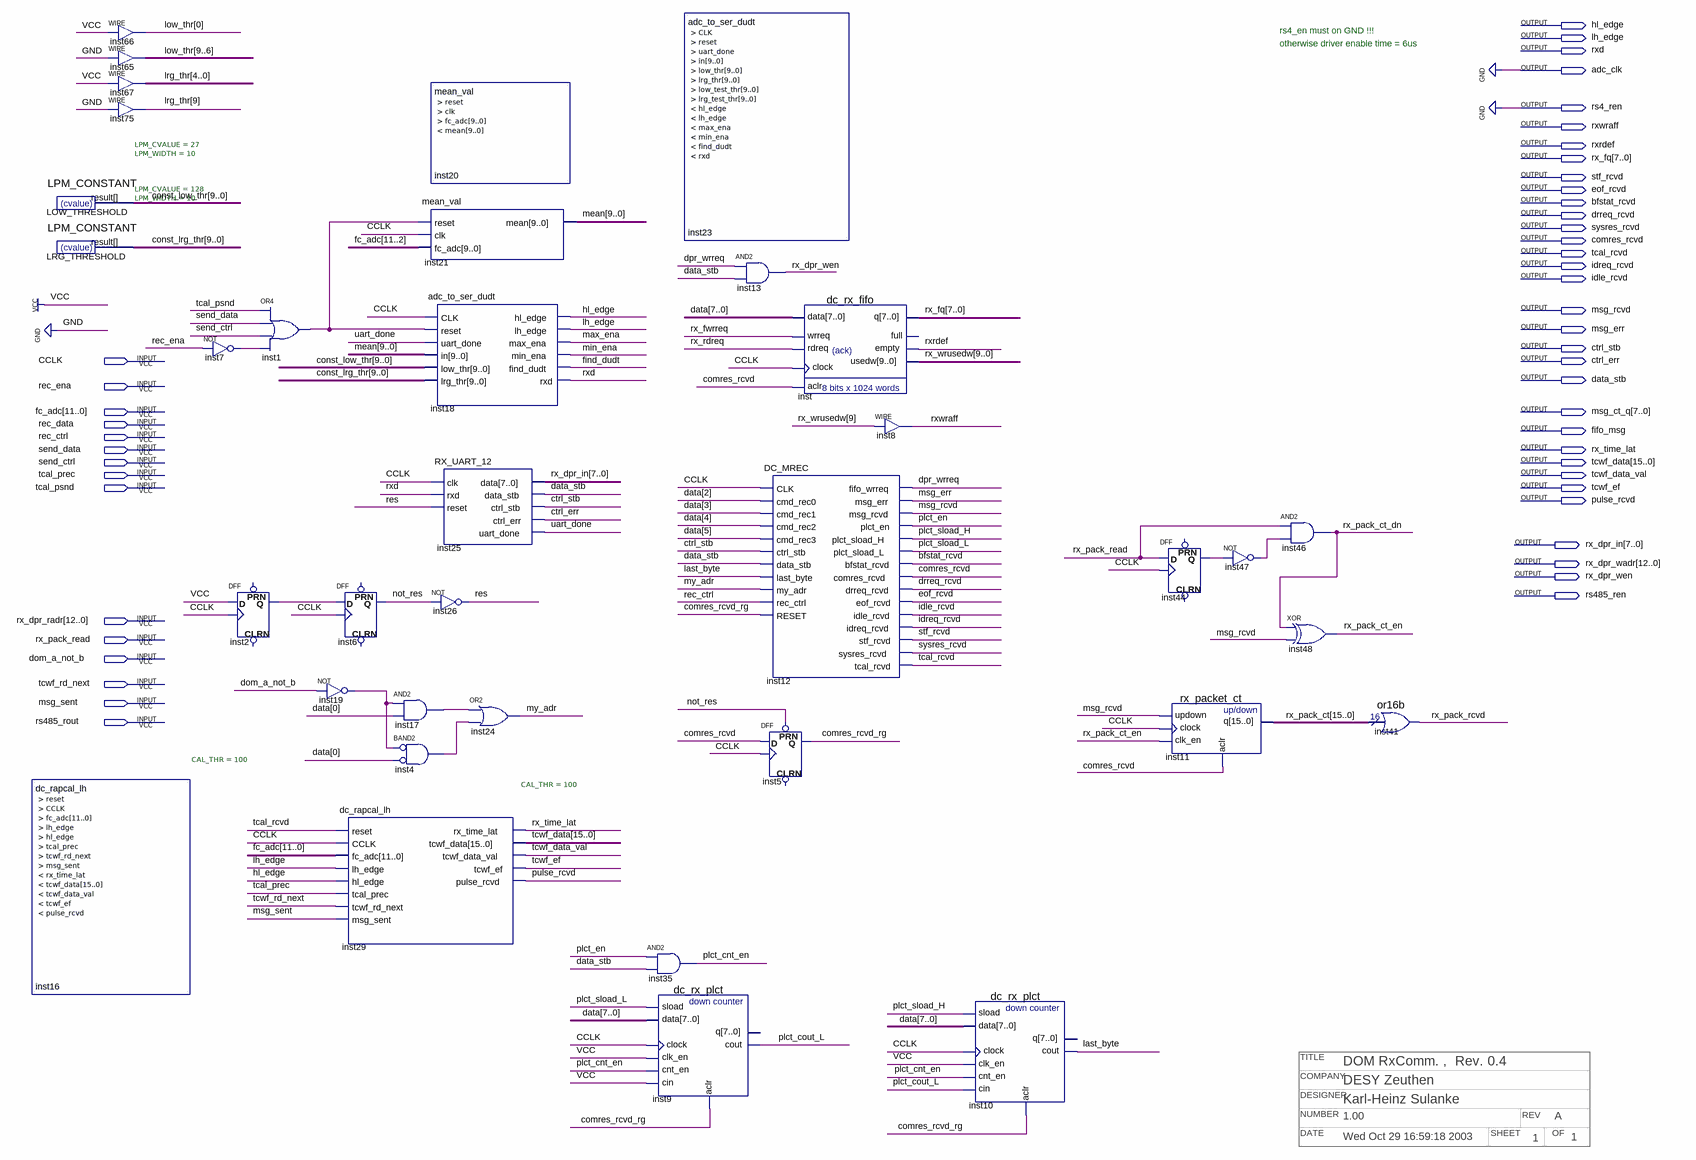
[diagram p0: schematic sheet]
// Quartus schematic DC_Rx_chan_dpr.bdf as structural Verilog: 36 symbols, 48 pins
// Title block: TITLE: DOM RxComm. ,  Rev. 0.4; COMPANY: DESY Zeuthen; DESIGNER: Karl-Heinz Sulanke; NUMBER: 1.00; REV: A; DATE: Wed Oct 29 16:59:18 2003; SHEET: 1; OF: 1
module DC_Rx_chan_dpr (
  input  CCLK,
  input  rec_ena,
  input  [11:0] fc_adc,
  input  rec_data,
  input  rec_ctrl,
  input  send_data,
  input  send_ctrl,
  input  tcal_prec,
  input  tcal_psnd,
  input  [12:0] rx_dpr_radr,
  input  rx_pack_read,
  input  dom_a_not_b,
  input  tcwf_rd_next,
  input  msg_sent,
  input  rs485_rout,
  output hl_edge,
  output lh_edge,
  output rxd,
  output adc_clk,
  output rs4_ren,
  output rxwraff,
  output rxrdef,
  output [7:0] rx_fq,
  output stf_rcvd,
  output eof_rcvd,
  output bfstat_rcvd,
  output drreq_rcvd,
  output sysres_rcvd,
  output comres_rcvd,
  output tcal_rcvd,
  output idreq_rcvd,
  output idle_rcvd,
  output msg_rcvd,
  output msg_err,
  output ctrl_stb,
  output ctrl_err,
  output data_stb,
  output [7:0] msg_ct_q,
  output fifo_msg,
  output rx_time_lat,
  output [15:0] tcwf_data,
  output tcwf_data_val,
  output tcwf_ef,
  output pulse_rcvd,
  output [7:0] rx_dpr_in,
  output [12:0] rx_dpr_wadr,
  output rx_dpr_wen,
  output rs485_ren
);

  wire comres_rcvd_rg, dpr_wrreq, find_dudt, inst1_out, inst2_q, inst4_out, inst7_out, inst17_out,
       inst19_out, inst44_q, inst47_out, last_byte, max_ena, min_ena, my_adr, not_res, plct_cnt_en,
       plct_cout_L, plct_en, plct_sload_H, plct_sload_L, res, rx_fwrreq, rx_pack_ct_dn, rx_pack_ct_en,
       rx_pack_rcvd, rx_rdreq, uart_done;
  wire [7:0] data;
  wire [9:0] const_low_thr, const_lrg_thr, low_thr, lrg_thr, mean, rx_wrusedw;
  wire [15:0] rx_pack_ct;

  LPM_CONSTANT #(.LPM_CVALUE(27), .LPM_WIDTH(10)) LOW_THRESHOLD (.result(const_low_thr));
  LPM_CONSTANT #(.LPM_CVALUE(128), .LPM_WIDTH(10)) LRG_THRESHOLD (.result(const_lrg_thr));
  dc_rapcal_lh #(.CAL_THR(100)) inst16 ();  // open: reset, CCLK, fc_adc, lh_edge, hl_edge, tcal_prec, tcwf_rd_next, msg_sent, rx_time_lat, tcwf_data, tcwf_data_val, tcwf_ef, pulse_rcvd
  assign low_thr[0] = 1'b1;  // WIRE inst66
  assign low_thr[9:6] = 4'b0000;  // WIRE inst65
  assign lrg_thr[4:0] = {5{1'b1}};  // WIRE inst67
  assign lrg_thr[9] = 1'b0;  // WIRE inst75
  not inst7 (inst7_out, rec_ena);
  or inst1 (inst1_out, tcal_psnd, send_data, send_ctrl, inst7_out);
  DFF inst2 (.CLK(CCLK), .D(1'b1), .Q(inst2_q));  // open: CLRN, PRN
  not inst19 (inst19_out, dom_a_not_b);
  DFF inst6 (.CLK(CCLK), .D(inst2_q), .Q(not_res));  // open: CLRN, PRN
  dc_rapcal_lh #(.CAL_THR(100)) inst29 (
    .reset(tcal_rcvd), .CCLK(CCLK), .fc_adc(fc_adc), .lh_edge(lh_edge), .hl_edge(hl_edge),
    .tcal_prec(tcal_prec), .tcwf_rd_next(tcwf_rd_next), .msg_sent(msg_sent), .rx_time_lat(rx_time_lat),
    .tcwf_data(tcwf_data), .tcwf_data_val(tcwf_data_val), .tcwf_ef(tcwf_ef), .pulse_rcvd(pulse_rcvd));
  mean_val inst21 (.reset(inst1_out), .clk(CCLK), .fc_adc(fc_adc[11:2]), .mean(mean));
  adc_to_ser_dudt inst18 (
    .CLK(CCLK), .reset(inst1_out), .uart_done(uart_done), .in(mean), .low_thr(const_low_thr),
    .lrg_thr(const_lrg_thr), .hl_edge(hl_edge), .lh_edge(lh_edge), .max_ena(max_ena), .min_ena(min_ena),
    .find_dudt(find_dudt), .rxd(rxd));
  and inst17 (inst17_out, inst19_out, data[0]);
  and inst4 (inst4_out, ~inst19_out, ~data[0]);  // BAND2
  mean_val inst20 ();  // open: reset, clk, fc_adc, mean
  RX_UART_12 inst25 (
    .clk(CCLK), .rxd(rxd), .reset(res), .data(rx_dpr_in), .data_stb(data_stb), .ctrl_stb(ctrl_stb),
    .ctrl_err(ctrl_err), .uart_done(uart_done));
  not inst26 (res, not_res);
  or inst24 (my_adr, inst17_out, inst4_out);
  and inst35 (plct_cnt_en, plct_en, data_stb);
  dc_rx_plct inst9 (
    .sload(plct_sload_L), .data(data), .clock(CCLK), .clk_en(1'b1), .cnt_en(plct_cnt_en), .cin(1'b1),
    .aclr(comres_rcvd_rg), .cout(plct_cout_L));  // open: q
  adc_to_ser_dudt inst23 ();  // open: CLK, reset, uart_done, in, low_thr, lrg_thr, low_test_thr, lrg_test_thr, hl_edge, lh_edge, max_ena, min_ena, find_dudt, rxd
  and inst13 (rx_dpr_wen, dpr_wrreq, data_stb);
  DC_MREC inst12 (
    .CLK(CCLK), .cmd_rec0(data[2]), .cmd_rec1(data[3]), .cmd_rec2(data[4]), .cmd_rec3(data[5]),
    .ctrl_stb(ctrl_stb), .data_stb(data_stb), .last_byte(last_byte), .my_adr(my_adr), .rec_ctrl(rec_ctrl),
    .RESET(comres_rcvd_rg), .fifo_wrreq(dpr_wrreq), .msg_err(msg_err), .msg_rcvd(msg_rcvd),
    .plct_en(plct_en), .plct_sload_H(plct_sload_H), .plct_sload_L(plct_sload_L), .bfstat_rcvd(bfstat_rcvd),
    .comres_rcvd(comres_rcvd), .drreq_rcvd(drreq_rcvd), .eof_rcvd(eof_rcvd), .idle_rcvd(idle_rcvd),
    .idreq_rcvd(idreq_rcvd), .stf_rcvd(stf_rcvd), .sysres_rcvd(sysres_rcvd), .tcal_rcvd(tcal_rcvd));
  DFF inst5 (.CLK(CCLK), .D(comres_rcvd), .PRN(not_res), .Q(comres_rcvd_rg));  // open: CLRN
  dc_rx_fifo inst (
    .data(data), .wrreq(rx_fwrreq), .rdreq(rx_rdreq), .clock(CCLK), .aclr(comres_rcvd), .q(rx_fq),
    .empty(rxrdef), .usedw(rx_wrusedw));  // open: full
  assign rxwraff = rx_wrusedw[9];  // WIRE inst8
  dc_rx_plct inst10 (
    .sload(plct_sload_H), .data(data), .clock(CCLK), .clk_en(1'b1), .cnt_en(plct_cnt_en), .cin(plct_cout_L),
    .aclr(comres_rcvd_rg), .cout(last_byte));  // open: q
  DFF inst44 (.CLK(CCLK), .D(rx_pack_read), .Q(inst44_q));  // open: CLRN, PRN
  rx_packet_ct inst11 (.updown(msg_rcvd), .clock(CCLK), .clk_en(rx_pack_ct_en), .aclr(comres_rcvd), .q(rx_pack_ct));
  not inst47 (inst47_out, inst44_q);
  and inst46 (rx_pack_ct_dn, rx_pack_read, inst47_out);
  xor inst48 (rx_pack_ct_en, rx_pack_ct_dn, msg_rcvd);
  or16b inst41 (.data(rx_pack_ct), .result(rx_pack_rcvd));

  assign rs4_ren = 1'b0;

  // Notes on the sheet:
  //   rs4_en must on GND !!!
  //   otherwise driver enable time = 6us
endmodule
